# Altium project LED_TRIANGEL.PrjPcb
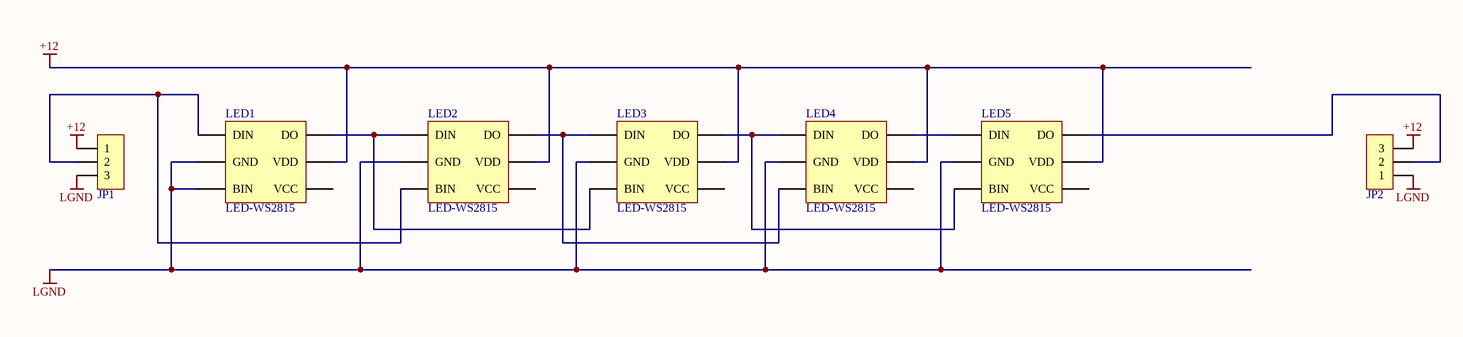
[diagram p0: LED_TRIANGEL.SchDoc]
1 sheet, 7 parts. Net scope: global (net labels, ports and power ports of the same name join across sheets).
Board file: LED_TRIANGEL.PcbDoc

## Sheet LED_TRIANGEL.SchDoc
size A4

### Parts
JP1  HDR-1X3  [ZH1.5-WS-3P]  (value not drawn)
JP2  HDR-1X3  [ZH1.5-WS-3P]  (value not drawn)
LED1  LED-WS2815  [LED 5050]
LED2  LED-WS2815  [LED 5050]
LED3  LED-WS2815  [LED 5050]
LED4  LED-WS2815  [LED 5050]
LED5  LED-WS2815  [LED 5050]

### Nets
+12: JP1.1 JP2.3 LED1.4(VDD) LED2.4(VDD) LED3.4(VDD) LED4.4(VDD) LED5.4(VDD)
LGND: JP1.3 JP2.1 LED1.3(GND) LED1.5(BIN) LED2.3(GND) LED3.3(GND) LED4.3(GND) LED5.3(GND)
NetJP1_2: JP1.2 LED1.1(DIN) LED2.5(BIN)
NetJP2_2: JP2.2 LED5.2(DO)
NetLED1_2: LED1.2(DO) LED2.1(DIN) LED3.5(BIN)
NetLED2_2: LED2.2(DO) LED3.1(DIN) LED4.5(BIN)
NetLED3_2: LED3.2(DO) LED4.1(DIN) LED5.5(BIN)
NetLED4_2: LED4.2(DO) LED5.1(DIN)

Not connected (* = marked no-connect by the designer): LED1 6(VCC); LED2 6(VCC); LED3 6(VCC); LED4 6(VCC); LED5 6(VCC)

### Library data of the parts
JP1 JP2 = Header 3: 3P接插件; 版权归属: 源创客; BOM名称: 3P接插件; 学习资源: www.ooocke.com
LED1-LED5 = LED-WS2815: 三基色LED; 版权归属: 源创客; BOM名称: 三基色LED; 学习资源: www.ooocke.com